# Altium project Mordovia_MCH_CLK.PrjPCB (part 1 of 2)
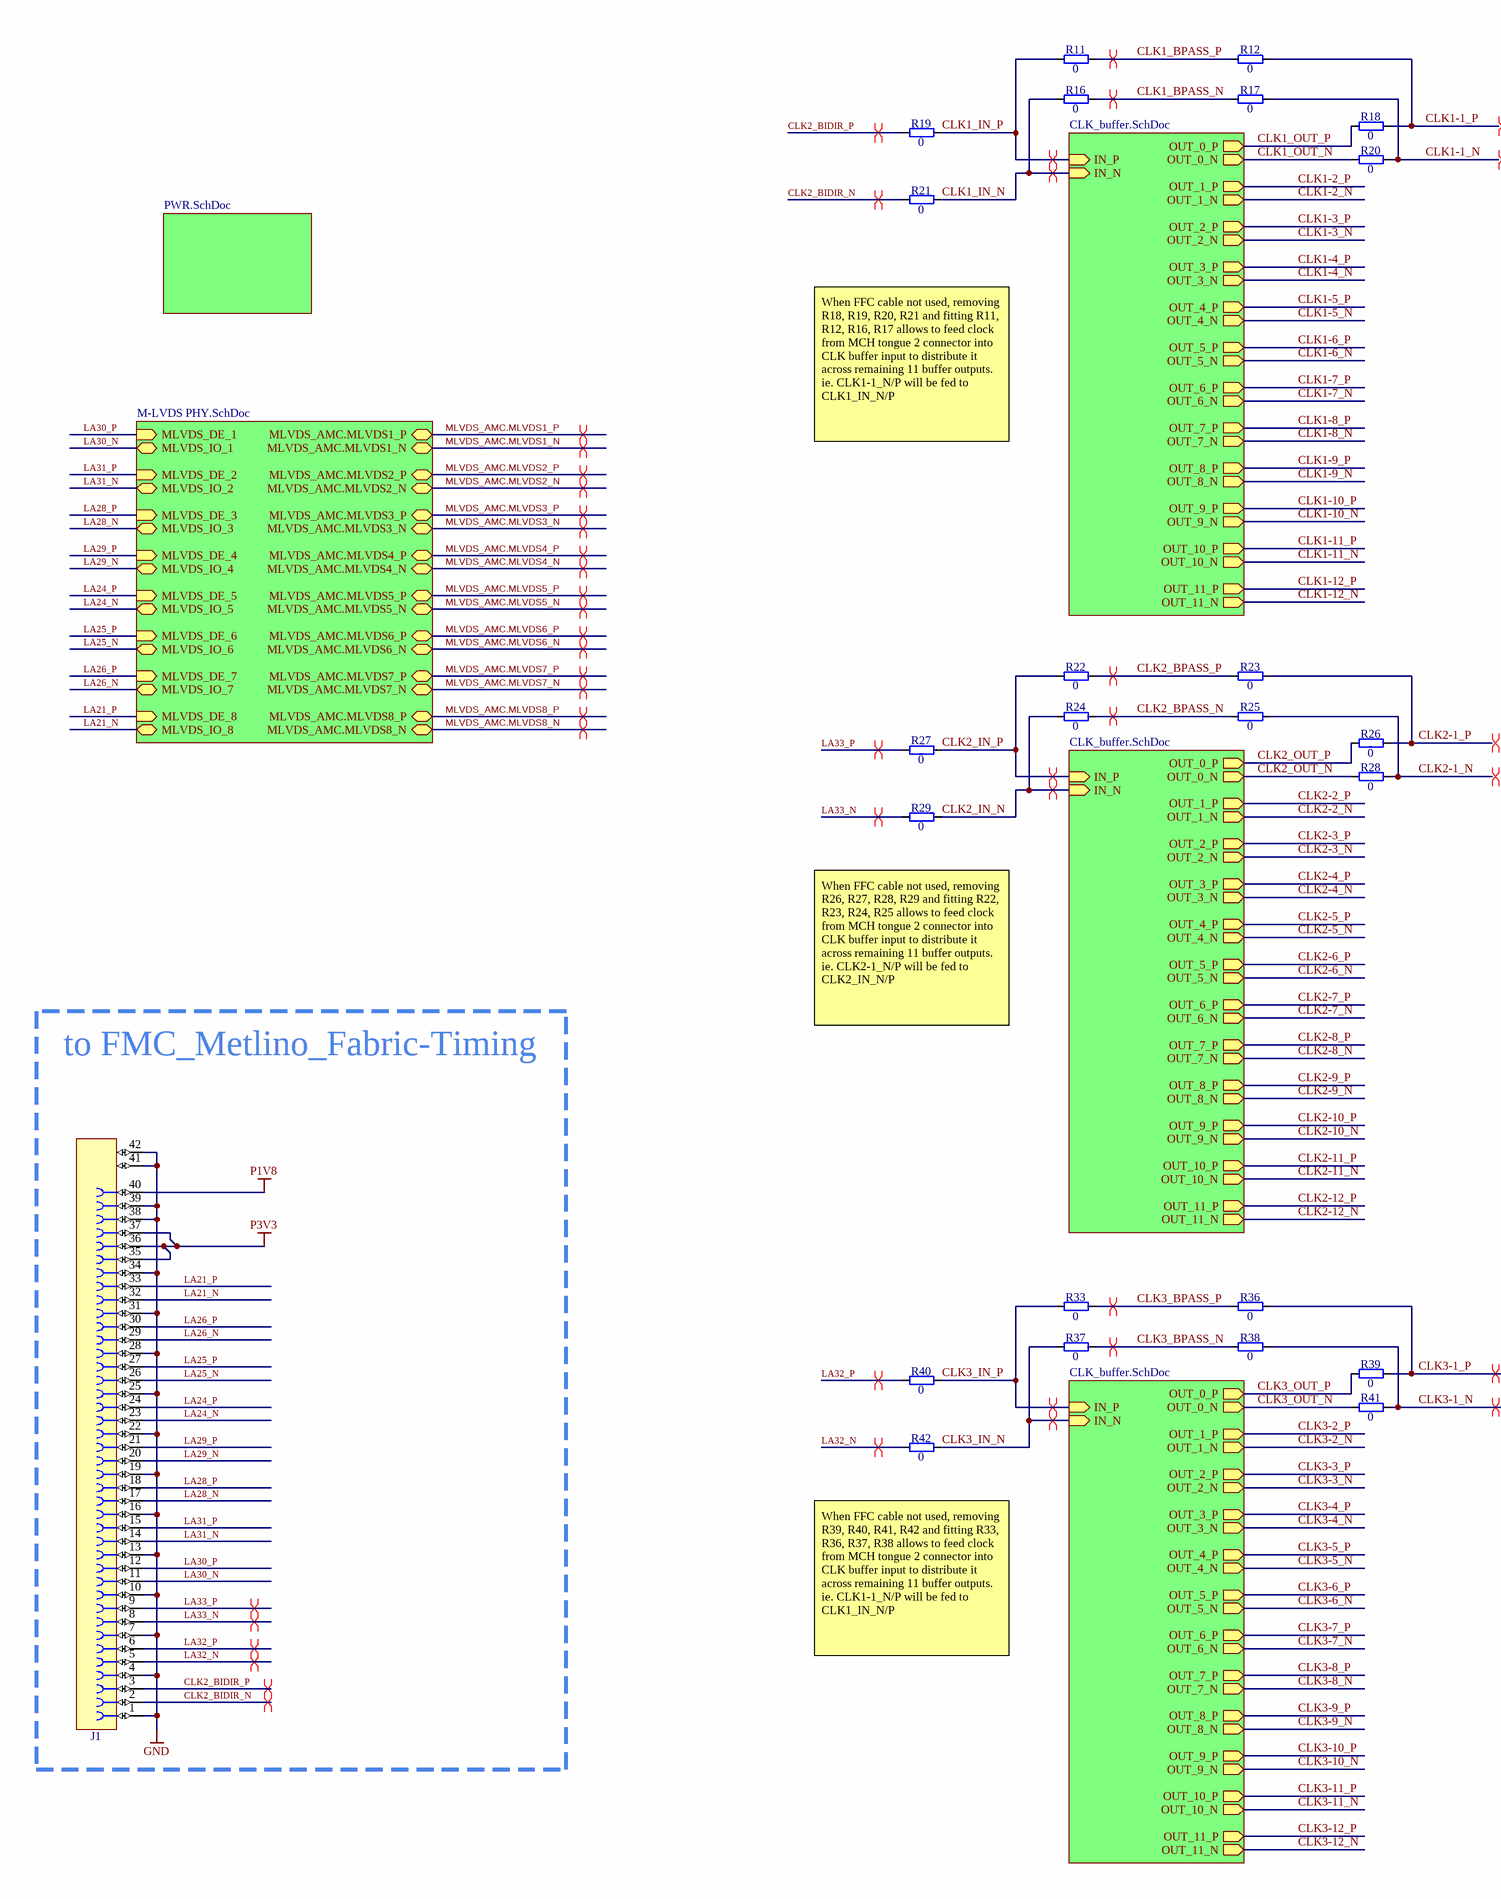
[diagram p0: Mordovia_MCH_CLK.SchDoc, left]
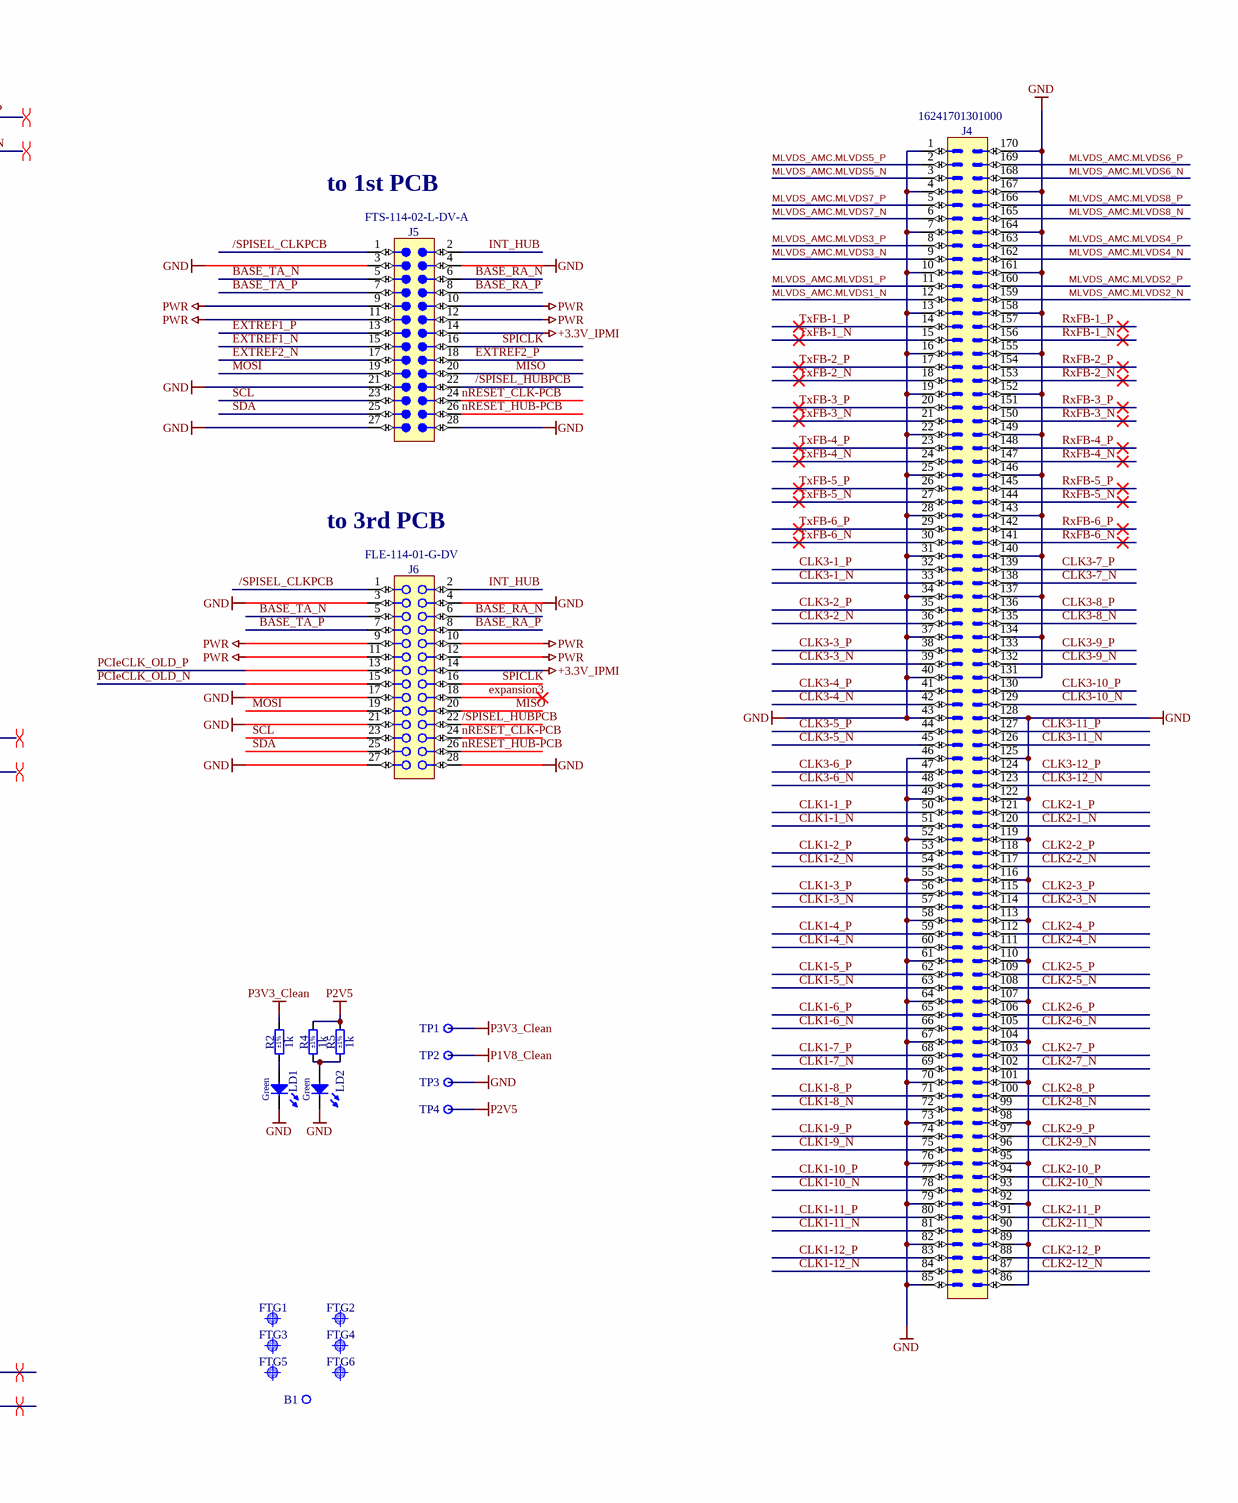
[diagram p1: Mordovia_MCH_CLK.SchDoc, right]
4 sheets, 182 parts. Net scope: hierarchical (ports join the sheet entries above them; power ports are global).
Board file: Mordovia_MCH_CLK.PcbDoc
Sheets:
  Mordovia_MCH_CLK.SchDoc
    2 = CLK_buffer.SchDoc
    3 = CLK_buffer.SchDoc
    m-lvds = M-LVDS PHY.SchDoc
    PWR = PWR.SchDoc
    1 = CLK_buffer.SchDoc

## Sheet Mordovia_MCH_CLK.SchDoc: Mordovia_MCH_CLK
size 594 x 420 mm; PageSetup: Record=PageOptions|CenterHorizontal=True|CenterVertical=True|PrintScale=0.73|XCorrection==PcbVersion0|YCorrection==PcbVersion0|PrintKind=2|BorderSize=5000000|LeftOffset=0|BottomOffset=0|Orientation=2|PaperLength=1000|PaperWidth=1000|Scale=100|PaperSource=7|PrintQuality=600|MediaType=1|DitherType=10|PaperKind=A4|PrintScaleMode=1; CheckedBy: -; CompanyName: PW ISE; DrawnBy: F. Świtakowski; Organization: ISE; Address1: WUT ISE; Address2: Nowowiejska 15/19 00-665 Warsaw; Address3: gkasprow@gmail.com; Revision: 1; SheetNumber: -; SheetTotal: -; Projet: Mordovia_MCH_CLK.PrjPCB; ModifiedBy: -; CreateDate: -; CheckedDate: -; Title2: Thongue 2 adapter; DivGrp: PERG; Designer: F. Świtakowski; ModifiedDate: -

### Parts
B1  Non Plated Hole  [MTG520]  (value not drawn)  (no BOM)
FTG1  Use only in PCB  [FIDUCIAL_TOP_S100-200]  (value not drawn)  (no BOM)
FTG2  Use only in PCB  [FIDUCIAL_TOP_S100-200]  (value not drawn)  (no BOM)
FTG3  Use only in PCB  [FIDUCIAL_TOP_S100-200]  (value not drawn)  (no BOM)
FTG4  Use only in PCB  [FIDUCIAL_TOP_S100-200]  (value not drawn)  (no BOM)
FTG5  Use only in PCB  [FIDUCIAL_TOP_S100-200]  (value not drawn)  (no BOM)
FTG6  Use only in PCB  [FIDUCIAL_TOP_S100-200]  (value not drawn)  (no BOM)
J1  FFC/FPC  [MOLEX_505110-4091]  (value not drawn)
J4  Manufacturer Part Number: 16241701301000  [ITB_16241701301000]
J5  Manufacturer Part Number: FTS-114-02-L-DV-A  [SAMTEC_FTS-114-02-L-DV-A]  (hidden comment: Header 28)
J6  Manufacturer Part Number: FLE-114-01-G-DV  [SAMTEC_FLE-114-01-G-DV]  (hidden comment: Socket 28)
LD1  Green  [LED_OSRAM_LGL29K]
LD2  Green  [LED_OSRAM_LGL29K]
R2  1k  Tolerance: ±1%  [RESC1005X40N]
R4  1k  Tolerance: ±1%  [RESC1005X40N]
R5  1k  Tolerance: ±1%  [RESC1005X40N]
R11  0  [RESC0603X28N]
R12  0  [RESC0603X28N]
R16  0  [RESC0603X28N]
R17  0  [RESC0603X28N]
R18  0  [RESC0603X28N]
R19  0  [RESC0603X28N]
R20  0  [RESC0603X28N]
R21  0  [RESC0603X28N]
R22  0  [RESC0603X28N]
R23  0  [RESC0603X28N]
R24  0  [RESC0603X28N]
R25  0  [RESC0603X28N]
R26  0  [RESC0603X28N]
R27  0  [RESC0603X28N]
R28  0  [RESC0603X28N]
R29  0  [RESC0603X28N]
R33  0  [RESC0603X28N]
R36  0  [RESC0603X28N]
R37  0  [RESC0603X28N]
R38  0  [RESC0603X28N]
R39  0  [RESC0603X28N]
R40  0  [RESC0603X28N]
R41  0  [RESC0603X28N]
R42  0  [RESC0603X28N]
TP1  Test Point  [TPS127]  (value not drawn)  (no BOM)
TP2  Test Point  [TPS127]  (value not drawn)  (no BOM)
TP3  Test Point  [TPS127]  (value not drawn)  (no BOM)
TP4  Test Point  [TPS127]  (value not drawn)  (no BOM)

### Blocks framed on the sheet
to FMC_Metlino_Fabric-Timing: J1

### Sub-sheets
1 = CLK_buffer.SchDoc: OUT_0_P (out), OUT_0_N (out), IN_P (in), IN_N (in), OUT_1_P (out), OUT_1_N (out), OUT_2_P (out), OUT_2_N (out), OUT_3_P (out), OUT_3_N (out), OUT_4_P (out), OUT_4_N (out), OUT_5_P (out), OUT_5_N (out), OUT_6_P (out), OUT_6_N (out), OUT_7_P (out), OUT_7_N (out), OUT_8_P (out), OUT_8_N (out), OUT_9_P (out), OUT_9_N (out), OUT_10_P (out), OUT_10_N (out), OUT_11_P (out), OUT_11_N (out)
2 = CLK_buffer.SchDoc: OUT_0_P (out), OUT_0_N (out), IN_P (in), IN_N (in), OUT_1_P (out), OUT_1_N (out), OUT_2_P (out), OUT_2_N (out), OUT_3_P (out), OUT_3_N (out), OUT_4_P (out), OUT_4_N (out), OUT_5_P (out), OUT_5_N (out), OUT_6_P (out), OUT_6_N (out), OUT_7_P (out), OUT_7_N (out), OUT_8_P (out), OUT_8_N (out), OUT_9_P (out), OUT_9_N (out), OUT_10_P (out), OUT_10_N (out), OUT_11_P (out), OUT_11_N (out)
3 = CLK_buffer.SchDoc: OUT_0_P (out), OUT_0_N (out), IN_P (in), IN_N (in), OUT_1_P (out), OUT_1_N (out), OUT_2_P (out), OUT_2_N (out), OUT_3_P (out), OUT_3_N (out), OUT_4_P (out), OUT_4_N (out), OUT_5_P (out), OUT_5_N (out), OUT_6_P (out), OUT_6_N (out), OUT_7_P (out), OUT_7_N (out), OUT_8_P (out), OUT_8_N (out), OUT_9_P (out), OUT_9_N (out), OUT_10_P (out), OUT_10_N (out), OUT_11_P (out), OUT_11_N (out)
m-lvds = M-LVDS PHY.SchDoc: MLVDS_DE_1 (in), MLVDS_IO_1 (bidir), MLVDS_AMC.MLVDS1_P (bidir), MLVDS_AMC.MLVDS1_N (bidir), MLVDS_DE_2 (in), MLVDS_IO_2 (bidir), MLVDS_AMC.MLVDS2_P (bidir), MLVDS_AMC.MLVDS2_N (bidir), MLVDS_DE_3 (in), MLVDS_IO_3 (bidir), MLVDS_AMC.MLVDS3_P (bidir), MLVDS_AMC.MLVDS3_N (bidir), MLVDS_DE_4 (in), MLVDS_IO_4 (bidir), MLVDS_AMC.MLVDS4_P (bidir), MLVDS_AMC.MLVDS4_N (bidir), MLVDS_DE_5 (in), MLVDS_IO_5 (bidir), MLVDS_AMC.MLVDS5_P (bidir), MLVDS_AMC.MLVDS5_N (bidir), MLVDS_DE_6 (in), MLVDS_IO_6 (bidir), MLVDS_AMC.MLVDS6_P (bidir), MLVDS_AMC.MLVDS6_N (bidir), MLVDS_DE_7 (in), MLVDS_IO_7 (bidir), MLVDS_AMC.MLVDS7_P (bidir), MLVDS_AMC.MLVDS7_N (bidir), MLVDS_DE_8 (in), MLVDS_IO_8 (bidir), MLVDS_AMC.MLVDS8_P (bidir), MLVDS_AMC.MLVDS8_N (bidir)
PWR = PWR.SchDoc: no entries

### Nets
+3.3V_IPMI: J5.14 J6.14
GND: J1.1 J1.4 J1.7 J1.10 J1.13 J1.16 J1.19 J1.22 J1.25 J1.28 J1.31 J1.34 J1.38 J1.39 J1.41 J1.42 J4.1 J4.4 J4.7 J4.10 J4.13 J4.16 J4.19 J4.22 J4.25 J4.28 J4.31 J4.34 J4.37 J4.40 J4.43 J4.46 J4.49 J4.52 J4.55 J4.58 J4.61 J4.64 J4.67 J4.70 J4.73 J4.76 J4.79 J4.82 J4.85 J4.86 J4.89 J4.92 J4.95 J4.98 J4.101 J4.104 J4.107 J4.110 J4.113 J4.116 J4.119 J4.122 J4.125 J4.128 J4.131 J4.134 J4.137 J4.140 J4.143 J4.146 J4.149 J4.152 J4.155 J4.158 J4.161 J4.164 J4.167 J4.170 J5.3 J5.4 J5.21 J5.27 J5.28 J6.3 J6.4 J6.17 J6.21 J6.27 J6.28 LD1.1(C) LD2.1(C) TP3.1
P1V8: J1.40
P1V8_Clean: TP2.1
P2V5: R4.2 R5.2 TP4.1
P3V3: J1.35 J1.36 J1.37
P3V3_Clean: R2.2 TP1.1
PWR: J5.9 J5.10 J5.11 J5.12 J6.9 J6.10 J6.11 J6.12
/SPISEL_CLKPCB: J5.1 J6.1
/SPISEL_HUBPCB: J5.22 J6.22
BASE_RA_N: J5.6 J6.6
BASE_RA_P: J5.8 J6.8
BASE_TA_N: J5.5 J6.5
BASE_TA_P: J5.7 J6.7
CLK1-1_N: J4.51 R17.2 R20.2
CLK1-1_P: J4.50 R12.2 R18.2
CLK1-2_N: J4.54 ; sheet 1/OUT_1_N
CLK1-2_P: J4.53 ; sheet 1/OUT_1_P
CLK1-3_N: J4.57 ; sheet 1/OUT_2_N
CLK1-3_P: J4.56 ; sheet 1/OUT_2_P
CLK1-4_N: J4.60 ; sheet 1/OUT_3_N
CLK1-4_P: J4.59 ; sheet 1/OUT_3_P
CLK1-5_N: J4.63 ; sheet 1/OUT_4_N
CLK1-5_P: J4.62 ; sheet 1/OUT_4_P
CLK1-6_N: J4.66 ; sheet 1/OUT_5_N
CLK1-6_P: J4.65 ; sheet 1/OUT_5_P
CLK1-7_N: J4.69 ; sheet 1/OUT_6_N
CLK1-7_P: J4.68 ; sheet 1/OUT_6_P
CLK1-8_N: J4.72 ; sheet 1/OUT_7_N
CLK1-8_P: J4.71 ; sheet 1/OUT_7_P
CLK1-9_N: J4.75 ; sheet 1/OUT_8_N
CLK1-9_P: J4.74 ; sheet 1/OUT_8_P
CLK1-10_N: J4.78 ; sheet 1/OUT_9_N
CLK1-10_P: J4.77 ; sheet 1/OUT_9_P
CLK1-11_N: J4.81 ; sheet 1/OUT_10_N
CLK1-11_P: J4.80 ; sheet 1/OUT_10_P
CLK1-12_N: J4.84 ; sheet 1/OUT_11_N
CLK1-12_P: J4.83 ; sheet 1/OUT_11_P
CLK1_BPASS_N: R16.2 R17.1
CLK1_BPASS_P: R11.2 R12.1
CLK1_IN_N: R16.1 R21.2 ; sheet 1/IN_N
CLK1_IN_P: R11.1 R19.2 ; sheet 1/IN_P
CLK1_OUT_N: R20.1 ; sheet 1/OUT_0_N
CLK1_OUT_P: R18.1 ; sheet 1/OUT_0_P
CLK2-1_N: J4.120 R25.2 R28.2
CLK2-1_P: J4.121 R23.2 R26.2
CLK2-2_N: J4.117 ; sheet 2/OUT_1_N
CLK2-2_P: J4.118 ; sheet 2/OUT_1_P
CLK2-3_N: J4.114 ; sheet 2/OUT_2_N
CLK2-3_P: J4.115 ; sheet 2/OUT_2_P
CLK2-4_N: J4.111 ; sheet 2/OUT_3_N
CLK2-4_P: J4.112 ; sheet 2/OUT_3_P
CLK2-5_N: J4.108 ; sheet 2/OUT_4_N
CLK2-5_P: J4.109 ; sheet 2/OUT_4_P
CLK2-6_N: J4.105 ; sheet 2/OUT_5_N
CLK2-6_P: J4.106 ; sheet 2/OUT_5_P
CLK2-7_N: J4.102 ; sheet 2/OUT_6_N
CLK2-7_P: J4.103 ; sheet 2/OUT_6_P
CLK2-8_N: J4.99 ; sheet 2/OUT_7_N
CLK2-8_P: J4.100 ; sheet 2/OUT_7_P
CLK2-9_N: J4.96 ; sheet 2/OUT_8_N
CLK2-9_P: J4.97 ; sheet 2/OUT_8_P
CLK2-10_N: J4.93 ; sheet 2/OUT_9_N
CLK2-10_P: J4.94 ; sheet 2/OUT_9_P
CLK2-11_N: J4.90 ; sheet 2/OUT_10_N
CLK2-11_P: J4.91 ; sheet 2/OUT_10_P
CLK2-12_N: J4.87 ; sheet 2/OUT_11_N
CLK2-12_P: J4.88 ; sheet 2/OUT_11_P
CLK2_BIDIR_N: J1.2 R21.1
CLK2_BIDIR_P: J1.3 R19.1
CLK2_BPASS_N: R24.2 R25.1
CLK2_BPASS_P: R22.2 R23.1
CLK2_IN_N: R24.1 R29.2 ; sheet 2/IN_N
CLK2_IN_P: R22.1 R27.2 ; sheet 2/IN_P
CLK2_OUT_N: R28.1 ; sheet 2/OUT_0_N
CLK2_OUT_P: R26.1 ; sheet 2/OUT_0_P
CLK3-1_N: J4.33 R38.2 R41.2
CLK3-1_P: J4.32 R36.2 R39.2
CLK3-2_N: J4.36 ; sheet 3/OUT_1_N
CLK3-2_P: J4.35 ; sheet 3/OUT_1_P
CLK3-3_N: J4.39 ; sheet 3/OUT_2_N
CLK3-3_P: J4.38 ; sheet 3/OUT_2_P
CLK3-4_N: J4.42 ; sheet 3/OUT_3_N
CLK3-4_P: J4.41 ; sheet 3/OUT_3_P
CLK3-5_N: J4.45 ; sheet 3/OUT_4_N
CLK3-5_P: J4.44 ; sheet 3/OUT_4_P
CLK3-6_N: J4.48 ; sheet 3/OUT_5_N
CLK3-6_P: J4.47 ; sheet 3/OUT_5_P
CLK3-7_N: J4.138 ; sheet 3/OUT_6_N
CLK3-7_P: J4.139 ; sheet 3/OUT_6_P
CLK3-8_N: J4.135 ; sheet 3/OUT_7_N
CLK3-8_P: J4.136 ; sheet 3/OUT_7_P
CLK3-9_N: J4.132 ; sheet 3/OUT_8_N
CLK3-9_P: J4.133 ; sheet 3/OUT_8_P
CLK3-10_N: J4.129 ; sheet 3/OUT_9_N
CLK3-10_P: J4.130 ; sheet 3/OUT_9_P
CLK3-11_N: J4.126 ; sheet 3/OUT_10_N
CLK3-11_P: J4.127 ; sheet 3/OUT_10_P
CLK3-12_N: J4.123 ; sheet 3/OUT_11_N
CLK3-12_P: J4.124 ; sheet 3/OUT_11_P
CLK3_BPASS_N: R37.2 R38.1
CLK3_BPASS_P: R33.2 R36.1
CLK3_IN_N: R37.1 R42.2 ; sheet 3/IN_N
CLK3_IN_P: R33.1 R40.2 ; sheet 3/IN_P
CLK3_OUT_N: R41.1 ; sheet 3/OUT_0_N
CLK3_OUT_P: R39.1 ; sheet 3/OUT_0_P
expansion3: J6.18
EXTREF1_N: J5.15
EXTREF1_P: J5.13
EXTREF2_N: J5.17
EXTREF2_P: J5.18
INT_HUB: J5.2 J6.2
LA21_N: J1.32 ; sheet m-lvds/MLVDS_IO_8
LA21_P: J1.33 ; sheet m-lvds/MLVDS_DE_8
LA24_N: J1.23 ; sheet m-lvds/MLVDS_IO_5
LA24_P: J1.24 ; sheet m-lvds/MLVDS_DE_5
LA25_N: J1.26 ; sheet m-lvds/MLVDS_IO_6
LA25_P: J1.27 ; sheet m-lvds/MLVDS_DE_6
LA26_N: J1.29 ; sheet m-lvds/MLVDS_IO_7
LA26_P: J1.30 ; sheet m-lvds/MLVDS_DE_7
LA28_N: J1.17 ; sheet m-lvds/MLVDS_IO_3
LA28_P: J1.18 ; sheet m-lvds/MLVDS_DE_3
LA29_N: J1.20 ; sheet m-lvds/MLVDS_IO_4
LA29_P: J1.21 ; sheet m-lvds/MLVDS_DE_4
LA30_N: J1.11 ; sheet m-lvds/MLVDS_IO_1
LA30_P: J1.12 ; sheet m-lvds/MLVDS_DE_1
LA31_N: J1.14 ; sheet m-lvds/MLVDS_IO_2
LA31_P: J1.15 ; sheet m-lvds/MLVDS_DE_2
LA32_N: J1.5 R42.1
LA32_P: J1.6 R40.1
LA33_N: J1.8 R29.1
LA33_P: J1.9 R27.1
MISO: J5.20 J6.20
MLVDS_AMC.MLVDS1_N: J4.12 ; sheet m-lvds/MLVDS_AMC.MLVDS1_N
MLVDS_AMC.MLVDS1_P: J4.11 ; sheet m-lvds/MLVDS_AMC.MLVDS1_P
MLVDS_AMC.MLVDS2_N: J4.159 ; sheet m-lvds/MLVDS_AMC.MLVDS2_N
MLVDS_AMC.MLVDS2_P: J4.160 ; sheet m-lvds/MLVDS_AMC.MLVDS2_P
MLVDS_AMC.MLVDS3_N: J4.9 ; sheet m-lvds/MLVDS_AMC.MLVDS3_N
MLVDS_AMC.MLVDS3_P: J4.8 ; sheet m-lvds/MLVDS_AMC.MLVDS3_P
MLVDS_AMC.MLVDS4_N: J4.162 ; sheet m-lvds/MLVDS_AMC.MLVDS4_N
MLVDS_AMC.MLVDS4_P: J4.163 ; sheet m-lvds/MLVDS_AMC.MLVDS4_P
MLVDS_AMC.MLVDS5_N: J4.3 ; sheet m-lvds/MLVDS_AMC.MLVDS5_N
MLVDS_AMC.MLVDS5_P: J4.2 ; sheet m-lvds/MLVDS_AMC.MLVDS5_P
MLVDS_AMC.MLVDS6_N: J4.168 ; sheet m-lvds/MLVDS_AMC.MLVDS6_N
MLVDS_AMC.MLVDS6_P: J4.169 ; sheet m-lvds/MLVDS_AMC.MLVDS6_P
MLVDS_AMC.MLVDS7_N: J4.6 ; sheet m-lvds/MLVDS_AMC.MLVDS7_N
MLVDS_AMC.MLVDS7_P: J4.5 ; sheet m-lvds/MLVDS_AMC.MLVDS7_P
MLVDS_AMC.MLVDS8_N: J4.165 ; sheet m-lvds/MLVDS_AMC.MLVDS8_N
MLVDS_AMC.MLVDS8_P: J4.166 ; sheet m-lvds/MLVDS_AMC.MLVDS8_P
MOSI: J5.19 J6.19
nRESET_CLK-PCB: J5.24 J6.24
nRESET_HUB-PCB: J5.26 J6.26
PCIeCLK_OLD_N: J6.15
PCIeCLK_OLD_P: J6.13
RxFB-1_N: J4.156
RxFB-1_P: J4.157
RxFB-2_N: J4.153
RxFB-2_P: J4.154
RxFB-3_N: J4.150
RxFB-3_P: J4.151
RxFB-4_N: J4.147
RxFB-4_P: J4.148
RxFB-5_N: J4.144
RxFB-5_P: J4.145
RxFB-6_N: J4.141
RxFB-6_P: J4.142
SCL: J5.23 J6.23
SDA: J5.25 J6.25
SPICLK: J5.16 J6.16
TxFB-1_N: J4.15
TxFB-1_P: J4.14
TxFB-2_N: J4.18
TxFB-2_P: J4.17
TxFB-3_N: J4.21
TxFB-3_P: J4.20
TxFB-4_N: J4.24
TxFB-4_P: J4.23
TxFB-5_N: J4.27
TxFB-5_P: J4.26
TxFB-6_N: J4.30
TxFB-6_P: J4.29
NetLD1_2: LD1.2(A) R2.1
NetLD2_2: LD2.2(A) R4.1 R5.1

Not connected (* = marked no-connect by the designer): B1 1

### Layout directives
differential pair: CLK1-1_N, CLK1-1_P, CLK1_BPASS_N, CLK1_BPASS_P, CLK1_IN_N, CLK1_IN_P, CLK2-1_N, CLK2-1_P, CLK2_BIDIR_N, CLK2_BIDIR_P, CLK2_BPASS_N, CLK2_BPASS_P, CLK2_IN_N, CLK2_IN_P, CLK3-1_N, CLK3-1_P, CLK3_BPASS_N, CLK3_BPASS_P, CLK3_IN_N, CLK3_IN_P, LA32_N, LA32_P, LA33_N, LA33_P, MLVDS_AMC.MLVDS1_N, MLVDS_AMC.MLVDS1_P, MLVDS_AMC.MLVDS2_N, MLVDS_AMC.MLVDS2_P, MLVDS_AMC.MLVDS3_N, MLVDS_AMC.MLVDS3_P, MLVDS_AMC.MLVDS4_N, MLVDS_AMC.MLVDS4_P, MLVDS_AMC.MLVDS5_N, MLVDS_AMC.MLVDS5_P, MLVDS_AMC.MLVDS6_N, MLVDS_AMC.MLVDS6_P, MLVDS_AMC.MLVDS7_N, MLVDS_AMC.MLVDS7_P, MLVDS_AMC.MLVDS8_N, MLVDS_AMC.MLVDS8_P

### Notes on the sheet
- to 1st PCB
- When FFC cable not used, removing R18, R19, R20, R21 and fitting R11, R12, R16, R17 allows to feed clock from MCH tongue 2 connector into CLK buffer input to distribute it across remaining 11 buffer outputs. ie. CLK1-1_N/P will be fed to CLK1_IN_N/P
- to 3rd PCB
- When FFC cable not used, removing R26, R27, R28, R29 and fitting R22, R23, R24, R25 allows to feed clock from MCH tongue 2 connector into CLK buffer input to distribute it across remaining 11 buffer outputs. ie. CLK2-1_N/P will be fed to CLK2_IN_N/P
- When FFC cable not used, removing R39, R40, R41, R42 and fitting R33, R36, R37, R38 allows to feed clock from MCH tongue 2 connector into CLK buffer input to distribute it across remaining 11 buffer outputs. ie. CLK1-1_N/P will be fed to CLK1_IN_N/P
- Project/Equipment
- Document
- File
- Designer
- Drawn by
- Check.by
- Last Mod.
- Copyright WUT ISE 2020.
  This documentation describes Open Hardware and is licensed under the CERN OHL v.1.2. You may redistribute and modify this documentation under the terms of the CERN OHL v.1.2. (http://ohwr.org/CERNOHL). This documentation is distributed WITHOUT ANY EXPRESS OR IMPLIED WARRANTY, INCLUDING OF MERCHANTABILITY, SATISFACTORY QUALITY AND FITNESS FOR A PARTICULAR PURPOSE. Please see the CERN OHL v.1.2 for applicable conditions.
- Contact
- Print Date
- Sheet
- Size
- A2
- of
- Rev

### Library data of the parts
B1 = NON-PLATED_HOLE5.2: Single Terminal Socket; Part Description: Non Plated Through Hole: Hole Dia.=5.2mm; Mounted: No; Part Number: NON-PLATED_HOLE5.2; Component Type: Standard (No BOM); Pin Count: 1; Family: Non Plated Hole; Socket: No; SMD: No; Sense: No; Status: None; ComponentHeight: 0mm; HelpURL: Undefined; Author: CERN DEM JMW; CreateDate: 27.09.2011; LatestRevisionDate: 27.09.2011; PackageDescription: Non Plated Through Hole: Hole Dia.=5.2mm
FTG1-FTG6 = FIDUCIAL_TARGET_S100-200: Fiducial Target; Part Description: Square Fiducial Target, Top Layer, 1.0mm, Top Solder 2.0mm, Keepout =2.0mm; Mounted: No; Part Number: FIDUCIAL_TARGET_S100-200; Component Type: Standard (No BOM); Pin Count: 1; Family: Fiducial; Socket: No; SMD: Yes; Sense: No; Status: None; ComponentHeight: 0mm; HelpURL: Undefined; Author: CERN DEM JLC; CreateDate: 09.02.2010; LatestRevisionDate: 04.04.2012; PackageDescription: Square Fiducial Target, Top Layer, 1.0mm, Top Solder 2.0mm, Keepout =2.0mm
J1 = MOLEX_505110-4091: Connector 40 Female +2; Part Description: Easy-On FFC/FPC Connector 0.50mm Pitch, FD19 Series, Right-Angle, Bottom Contact, 40 Circuits; Manufacturer: MOLEX; PressFit: No; Part Number: MOLEX_505110-4091; Component Kind: Standard; Component Type: Standard; Pin Count: 42; Family: FFC/FPC; Mounted: Yes; Socket: No; SMD: Yes; Sense: No; Status: None; Manufacturer Part Number: 505110-4091; ComponentHeight: 1.92mm; HelpURL: \\cern.ch\dfs\Applications\Altium\Datasheets\MOLEX_505110-4091.pdf; Author: CERN DEM JMW; CreateDate: 22.01.2019; LatestRevisionDate: 22.01.2019
J4 = ITB_16241701301000: Connector 170 Male; Part Description: 170 Poles, MCH-Plug Connector (Basic Side); Manufacturer: ITB ADVANCED CONNECTORS; PressFit: No; Part Number: ITB_16241701301000; Component Kind: Standard; Component Type: Standard; Pin Count: 170; Family: AvancedMC; Mounted: Yes; Socket: No; SMD: No; Sense: No; Status: None; ComponentHeight: 7.63mm; HelpURL: \\cern.ch\dfs\Applications\Altium\Datasheets\ITB_16241701301000.pdf; Author: CERN DEM MR; CreateDate: 17.05.2016; LatestRevisionDate: 17.05.2016
J5 = SAMTEC_FTS-114-02-L-DV-A: Connector 28 Male; Part Description: 28 Contacts, Pitch 1.27mm - Dual Row Surface Mount Straight Strip Header; Manufacturer: SAMTEC; PressFit: No; Part Number: SAMTEC_FTS-114-02-L-DV-A; Component Kind: Standard; Component Type: Standard; Pin Count: 28; Family: Header 28; Mounted: Yes; Socket: No; Sense: No; SMD: Yes; Status: None; ComponentHeight: 3.18mm; HelpURL: \\cern.ch\dfs\Applications\Altium\Datasheets\SAMTEC_FTS-114-02-L-DV-A.pdf; Author: CERN DEM MR; CreateDate: 07.03.2016; LatestRevisionDate: 07.03.2016
J6 = SAMTEC_FLE-114-01-G-DV: Connector 28 Female; Part Description: 28 Contacts - Pitch 1.27mm - Dual Row Surface Mount Receptacle; Manufacturer: SAMTEC; PressFit: No; Part Number: SAMTEC_FLE-114-01-G-DV; Component Kind: Standard; Component Type: Standard; Pin Count: 28; Family: Socket 28; Mounted: Yes; Socket: No; Sense: No; SMD: Yes; Status: None; ComponentHeight: 4.55mm; HelpURL: \\cern.ch\dfs\Applications\Altium\Datasheets\SAMTEC_FLE-114-01-G-DV.pdf; Author: CERN DEM MR; CreateDate: 07.03.2016; LatestRevisionDate: 07.03.2016
LD1 LD2 = LED_OSRAM_LG L29K-G2J1-24-Z: LED Green 1C 2A; Part Description: Surface Mount Green LED (0603 Case); Manufacturer: OSRAM; PressFit: No; Bonding: No; Status Comment: Sourcing Difficulty; Part Number: LED_OSRAM_LG L29K-G2J1-24-Z; Component Kind: Standard; Component Type: Standard; Color: Green; PackageDescription: Green Chip LED, 2-Leads, Body 1.7x0.8mm, IPC Medium Density; Status: Not Recommended; Manufacturer Part Number: LG L29K-G2J1-24-Z; Pin Count: 2; Case: 0603; Mounted: Yes; Socket: No; SMD: Yes; Sense: No; ComponentHeight: 0.67mm; HelpURL: \\cern.ch\dfs\Applications\Altium\Datasheets\LED_OSRAM_LGL29K.pdf; Author: CERN DEM JLC; CreateDate: 24.04.2012; LatestRevisionDate: 24.04.2012
R2 R4 R5 = R0402_1K_1%_0.0625W_100PPM: Resistor - 1%; Part Description: General Purpose Thick Film Chip Resistor; Manufacturer: GENERIC; Manufacturer1 Part Number: 232270671002L; TC: ±100ppm/°C; PressFit: No; Part Number: R0402_1K_1%_0.0625W_100PPM; Component Kind: Standard; Component Type: Standard; Pin Count: 2; Value: 1k; Status: Not Recommended; Power: 0.0625W; Manufacturer Part Number: R0402_1K_1%_0.0625W_100PPM; Case: 0402; Mounted: Yes; Sense: No; Socket: No; SMD: Yes; Manufacturer1 Example: YAGEO PHYCOMP; Manufacturer1 ComponentHeight: 0.4mm; HelpURL: \\cern.ch\dfs\Applications\Altium\Datasheets\R0402_Phycomp_RC0402.pdf; Author: CERN DEM JLC; CreateDate: 03.12.2007; LatestRevisionDate: 17.10.2012
R11 R12 R16-R29 R33 R36-R42 = R0201_0R_JUMPER: Resistor; Part Description: 1A (0.05R Max DC Resistance) Zero Ohm Jumper; Manufacturer: GENERIC; Manufacturer1 Part Number: CRCW02010000Z0ED; PressFit: No; Part Number: R0201_0R_JUMPER; Component Kind: Standard; Component Type: Standard; Pin Count: 2; Value: 0; Status: Not Recommended; Manufacturer Part Number: R0201_0R_JUMPER; Case: 0201; Mounted: Yes; Sense: No; Socket: No; SMD: Yes; Manufacturer1 Example: VISHAY; Manufacturer1 ComponentHeight: 0.27mm; HelpURL: \\cern.ch\dfs\Applications\Altium\Datasheets\R0201_VISHAY_CRCW e3.pdf; Author: CERN DEM JLC; CreateDate: 11/19/2014; LatestRevisionDate: 1/8/2015
TP1-TP4 = SMD_PAD_1.27X1.27MM: Part Description: 1.27mm x 1.27mm PCB Copper Area (SMD Test Point); Mounted: No; Part Number: SMD_PAD_1.27X1.27MM; Component Type: Standard (No BOM); Pin Count: 1; Family: Test Point; Socket: No; SMD: No; Sense: No; Status: None; ComponentHeight: 0mm; HelpURL: Undefined; Author: CERN DEM JLC; CreateDate: 12.01.2008; LatestRevisionDate: 12.01.2008; PackageDescription: 1.27mm x 1.27mm PCB Copper Area (SMD Test Point)

## Sheet CLK_buffer.SchDoc: Mordovia_MCH_CLK
size A4; Author: Filip Świtakowski; DrawnBy: Filip Świtakowski; DocumentNumber: 2; Revision: 1.0; SheetNumber: 2; SheetTotal: 4; ModifiedBy: -; CheckedDate: -; Title2: CLK_buffer; DivGrp: WUT ISE; Designer: Filip Świtakowski
Used 3 times, as channels 2, 3, 1. Parts and nets are listed once, with the designators drawn on the sheet.
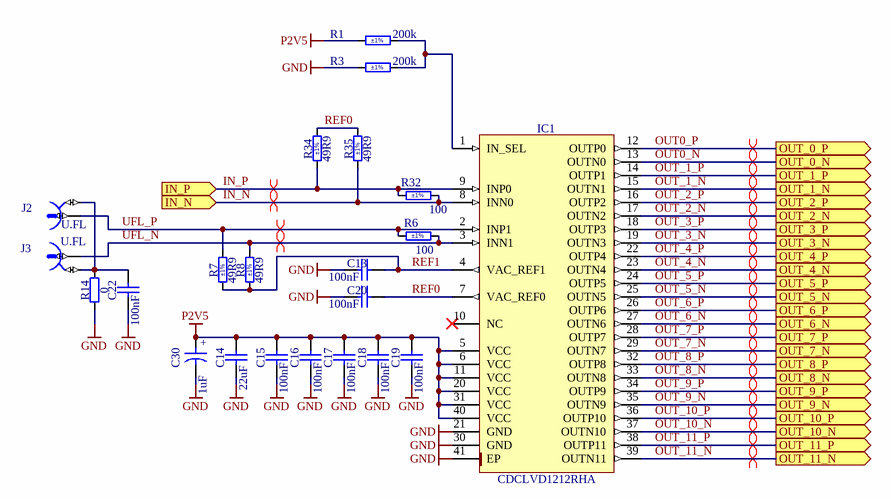
[diagram p2: CLK_buffer.SchDoc]

### Parts
C13  100nF  [CAPC1005X55N]
C14  22uF  [CAPC2012X135N]
C15  100nF  [CAPC1005X55N]
C16  100nF  [CAPC1005X55N]
C17  100nF  [CAPC1005X55N]
C18  100nF  [CAPC1005X55N]
C19  100nF  [CAPC1005X55N]
C20  100nF  [CAPC1005X55N]
C22  100nF  [CAPC1005X55N]
C30  1uF  [CAPMP3216X180N]
IC1  CDCLVD1212RHA  [QFN50P600X600X100-41N-S425]
J2  U.FL  [HIROSE_U.FL-R-SMT-1(10)]
J3  U.FL  [HIROSE_U.FL-R-SMT-1(10)]
R1  200k  Tolerance: ±1%  [RESC1005X40N]
R3  200k  Tolerance: ±1%  [RESC1005X40N]
R6  100  Tolerance: ±1%  [RESC1005X40N]
R7  49R9  Tolerance: ±1%  [RESC1005X40N]
R8  49R9  Tolerance: ±1%  [RESC1005X40N]
R14  0  [RESC1005X40N]
R32  100  Tolerance: ±1%  [RESC1005X40N]
R34  49R9  Tolerance: ±1%  [RESC1005X40N]
R35  49R9  Tolerance: ±1%  [RESC1005X40N]

### Ports
IN_N (in), IN_P (in), OUT_0_N (out), OUT_0_P (out), OUT_1_N (out), OUT_1_P (out), OUT_2_N (out), OUT_2_P (out), OUT_3_N (out), OUT_3_P (out), OUT_4_N (out), OUT_4_P (out), OUT_5_N (out), OUT_5_P (out), OUT_6_N (out), OUT_6_P (out), OUT_7_N (out), OUT_7_P (out), OUT_8_N (out), OUT_8_P (out), OUT_9_N (out), OUT_9_P (out), OUT_10_N (out), OUT_10_P (out), OUT_11_N (out), OUT_11_P (out)

### Nets
GND: C13.1 C14.1 C15.1 C16.1 C17.1 C18.1 C19.1 C20.1 C22.1 C30.2 IC1.21(GND) IC1.30(GND) IC1.41(EP) R3.1 R14.1
P2V5: C14.2 C15.2 C16.2 C17.2 C18.2 C19.2 C30.1 IC1.5(VCC) IC1.6(VCC) IC1.11(VCC) IC1.20(VCC) IC1.31(VCC) IC1.40(VCC) R1.1
IN_N: IC1.8(INN0) R32.2 R35.1 ; port IN_N
IN_P: IC1.9(INP0) R32.1 R34.1 ; port IN_P
OUT0_N: IC1.13(OUTN0) ; port OUT_0_N
OUT0_P: IC1.12(OUTP0) ; port OUT_0_P
OUT_1_N: IC1.15(OUTN1) ; port OUT_1_N
OUT_1_P: IC1.14(OUTP1) ; port OUT_1_P
OUT_2_N: IC1.17(OUTN2) ; port OUT_2_N
OUT_2_P: IC1.16(OUTP2) ; port OUT_2_P
OUT_3_N: IC1.19(OUTN3) ; port OUT_3_N
OUT_3_P: IC1.18(OUTP3) ; port OUT_3_P
OUT_~{4}_N: IC1.23(OUTN4) ; port OUT_4_N
OUT_4_P: IC1.22(OUTP4) ; port OUT_4_P
OUT_5_N: IC1.25(OUTN5) ; port OUT_5_N
OUT_5_P: IC1.24(OUTP5) ; port OUT_5_P
OUT_6_N: IC1.27(OUTN6) ; port OUT_6_N
OUT_6_P: IC1.26(OUTP6) ; port OUT_6_P
OUT_7_N: IC1.29(OUTN7) ; port OUT_7_N
OUT_7_P: IC1.28(OUTP7) ; port OUT_7_P
OUT_8_N: IC1.33(OUTN8) ; port OUT_8_N
OUT_8_P: IC1.32(OUTP8) ; port OUT_8_P
OUT_9_N: IC1.35(OUTN9) ; port OUT_9_N
OUT_9_P: IC1.34(OUTP9) ; port OUT_9_P
OUT_10_N: IC1.37(OUTN10) ; port OUT_10_N
OUT_10_P: IC1.36(OUTP10) ; port OUT_10_P
OUT_11_N: IC1.39(OUTN11) ; port OUT_11_N
OUT_11_P: IC1.38(OUTP11) ; port OUT_11_P
REF0: C20.2 IC1.7(VAC_REF0) R34.2 R35.2
REF1: C13.2 IC1.4(VAC_REF1) R7.1 R8.1
UFL_N: IC1.3(INN1) J3.1 R6.2 R8.2
UFL_P: IC1.2(INP1) J2.1 R6.1 R7.2
NetC22_2: C22.2 J2.2 J3.2 R14.2
NetIC1_1: IC1.1(IN_SEL) R1.2 R3.2

Not connected (* = marked no-connect by the designer): IC1 10(NC)*

### Channels
2: designators end in _2; ports IN_N=CLK2_IN_N IN_P=CLK2_IN_P OUT_0_N=CLK2_OUT_N OUT_0_P=CLK2_OUT_P OUT_1_N=CLK2-2_N OUT_1_P=CLK2-2_P OUT_2_N=CLK2-3_N OUT_2_P=CLK2-3_P OUT_3_N=CLK2-4_N OUT_3_P=CLK2-4_P OUT_4_N=CLK2-5_N OUT_4_P=CLK2-5_P OUT_5_N=CLK2-6_N OUT_5_P=CLK2-6_P OUT_6_N=CLK2-7_N OUT_6_P=CLK2-7_P OUT_7_N=CLK2-8_N OUT_7_P=CLK2-8_P OUT_8_N=CLK2-9_N OUT_8_P=CLK2-9_P OUT_9_N=CLK2-10_N OUT_9_P=CLK2-10_P OUT_10_N=CLK2-11_N OUT_10_P=CLK2-11_P OUT_11_N=CLK2-12_N OUT_11_P=CLK2-12_P
3: designators end in _3; ports IN_N=CLK3_IN_N IN_P=CLK3_IN_P OUT_0_N=CLK3_OUT_N OUT_0_P=CLK3_OUT_P OUT_1_N=CLK3-2_N OUT_1_P=CLK3-2_P OUT_2_N=CLK3-3_N OUT_2_P=CLK3-3_P OUT_3_N=CLK3-4_N OUT_3_P=CLK3-4_P OUT_4_N=CLK3-5_N OUT_4_P=CLK3-5_P OUT_5_N=CLK3-6_N OUT_5_P=CLK3-6_P OUT_6_N=CLK3-7_N OUT_6_P=CLK3-7_P OUT_7_N=CLK3-8_N OUT_7_P=CLK3-8_P OUT_8_N=CLK3-9_N OUT_8_P=CLK3-9_P OUT_9_N=CLK3-10_N OUT_9_P=CLK3-10_P OUT_10_N=CLK3-11_N OUT_10_P=CLK3-11_P OUT_11_N=CLK3-12_N OUT_11_P=CLK3-12_P
1: designators end in _1; ports IN_N=CLK1_IN_N IN_P=CLK1_IN_P OUT_0_N=CLK1_OUT_N OUT_0_P=CLK1_OUT_P OUT_1_N=CLK1-2_N OUT_1_P=CLK1-2_P OUT_2_N=CLK1-3_N OUT_2_P=CLK1-3_P OUT_3_N=CLK1-4_N OUT_3_P=CLK1-4_P OUT_4_N=CLK1-5_N OUT_4_P=CLK1-5_P OUT_5_N=CLK1-6_N OUT_5_P=CLK1-6_P OUT_6_N=CLK1-7_N OUT_6_P=CLK1-7_P OUT_7_N=CLK1-8_N OUT_7_P=CLK1-8_P OUT_8_N=CLK1-9_N OUT_8_P=CLK1-9_P OUT_9_N=CLK1-10_N OUT_9_P=CLK1-10_P OUT_10_N=CLK1-11_N OUT_10_P=CLK1-11_P OUT_11_N=CLK1-12_N OUT_11_P=CLK1-12_P

### Layout directives
differential pair: CLK2-2_N, CLK2-2_P, CLK2-3_N, CLK2-3_P, CLK2-4_N, CLK2-4_P, CLK2-5_N, CLK2-5_P, CLK2-6_N, CLK2-6_P, CLK2-7_N, CLK2-7_P, CLK2-8_N, CLK2-8_P, CLK2-9_N, CLK2-9_P, CLK2-10_N, CLK2-10_P, CLK2-11_N, CLK2-11_P, CLK2-12_N, CLK2-12_P, CLK2_IN_N, CLK2_IN_P, CLK2_OUT_N, CLK2_OUT_P, UFL_N_2, UFL_P_2

### Notes on the sheet
- Project/Equipment
- Document
- Designer
- Drawn by
- Check.by
- 01.20201
- PW ISE
- Contact
- File
- Last Mod.
- Print Date
- Sheet
- Size
- A4
- of
- Rev
- Copyright WUT ISE 2021.
  This documentation describes Open Hardware and is licensed under the CERN OHL v.1.2. You may redistribute and modify this documentation under the terms of the CERN OHL v.1.2. (http://ohwr.org/CERNOHL). This documentation is distributed WITHOUT ANY EXPRESS OR IMPLIED WARRANTY, INCLUDING OF MERCHANTABILITY, SATISFACTORY QUALITY AND FITNESS FOR A PARTICULAR PURPOSE. Please see the CERN OHL v.1.2 for applicable conditions.
- Nowowiejska 15/19 00-665 Warsaw
- (in symbol CTE3216-18_1UF_16V_10%) +

### Library data of the parts
C13 C15-C20 C22 = CC0402_100NF_50V_10%_X7R: Non-polarised capacitor; Part Description: SMD Multilayer Chip Ceramic Capacitor; Manufacturer: GENERIC; Manufacturer1 Part Number: GRM155R71H104KE14D; Voltage: 50V; TC: X7R; Tolerance: ±10%; Part Number: CC0402_100NF_50V_10%_X7R; Component Kind: Standard; Component Type: Standard; Pin Count: 2; Value: 100nF; Status: None; Manufacturer Part Number: CC0402_100NF_50V_10%_X7R; Case: 0402; Mounted: Yes; Socket: No; SMD: Yes; Sense: No; Manufacturer1 Example: MURATA; Manufacturer1 ComponentHeight: 0.55mm; HelpURL: \\cern.ch\dfs\Applications\Altium\Datasheets\CC0402_MURATA_GRM155R71H104KE14D.pdf; Author: CERN DEM MR; CreateDate: 30.06.2017; LatestRevisionDate: 30.06.2017
C14 = CC0805_22UF_16V_10%_X5R: Non-polarised capacitor; Part Description: SMD Multilayer Chip Ceramic Capacitor; Manufacturer: GENERIC; Manufacturer1 Part Number: C2012X5R1C226KT; Voltage: 16V; TC: X5R; Tolerance: ±10%; Part Number: CC0805_22UF_16V_10%_X5R; Component Kind: Standard; Component Type: Standard; Pin Count: 2; Value: 22uF; Status: Preferred; Manufacturer Part Number: CC0805_22UF_16V_10%_X5R; Case: 0805; Mounted: Yes; Socket: No; SMD: Yes; Sense: No; Manufacturer1 Example: TDK; Manufacturer1 ComponentHeight: 1.35mm; HelpURL: \\cern.ch\dfs\Applications\Altium\Datasheets\CC0805_X5R_TDK_C.pdf; Author: CERN DEM JLC; CreateDate: 25.10.2012; LatestRevisionDate: 25.10.2012
C30 = CTE3216-18_1UF_16V_10%: Polarised capacitor; Part Description: Solid Tantalum Chip Capacitor; Manufacturer: GENERIC; Manufacturer1 Part Number: TAJA105K016RNJ; Voltage: 16V; Tolerance: ±10%; Part Number: CTE3216-18_1UF_16V_10%; Component Kind: Standard; Component Type: Standard; Pin Count: 2; Value: 1uF; Status: Preferred; Manufacturer Part Number: CTE3216-18_1UF_16V_10%; Case: A; Mounted: Yes; Socket: No; SMD: Yes; Sense: No; Manufacturer1 Example: AVX; Manufacturer1 ComponentHeight: 1.8mm; HelpURL: \\cern.ch\dfs\Applications\Altium\Datasheets\CTE_AVX_TAJ.pdf; Author: CERN DEM JLC; CreateDate: 03.09.2012; LatestRevisionDate: 03.09.2012
IC1 = CDCLVD1212RHA: 2:12 Low Additive Jitter LVDS Buffer; Manufacturer: TEXAS INSTRUMENTS; PressFit: No; Bonding: No; Part Number: CDCLVD1212RHA; Component Kind: Standard; Component Type: Standard; Device: CDCLVD1212RHA; PackageDescription: QFN, 0.50mm Pitch, Square; 40 pin, 6.00mm L X 6.00mm W X 1.00mm H body (w/Thermal Tab 4.25 X 4.25mm), IPC Medium Density; Part Description: 2:12 Low Additive Jitter LVDS Buffer; Manufacturer Part Number: CDCLVD1212RHA; Pin Count: 41; Case: QFN40; Mounted: Yes; Socket: No; SMD: Yes; Sense: No; ComponentHeight: 1mm; HelpURL: \\cern.ch\dfs\Applications\Altium\Datasheets\CDCLVD1212RHA.pdf; Author: CERN DEM MR; CreateDate: 15.09.2017; LatestRevisionDate: 15.09.2017
J2 J3 = HIROSE_U.FL-R-SMT-1(10): Manufacturer: HIROSE (HRS); Part Description: Up to 6GHz Ultra Small Surface Mount Male Coaxial Connectors U.FL Series; PressFit: No; Manufacturer Part Number: U.FL-R-SMT-1(10); Part Number: HIROSE_U.FL-R-SMT-1(10); Component Kind: Standard; Component Type: Standard; Pin Count: 2; Family: U.FL; Mounted: Yes; Socket: No; SMD: Yes; Sense: No; Status: None; ComponentHeight: 1.25mm; HelpURL: \\cern.ch\dfs\Applications\Altium\Datasheets\HIROSE_U.FL-R-SMT-1(10).pdf; Author: CERN DEM JLC; CreateDate: 24.03.2010; LatestRevisionDate: 24.03.2010
R1 R3 = R0402_200K_1%_0.0625W_100PPM: Resistor - 1%; Part Description: General Purpose Thick Film Chip Resistor; Manufacturer: GENERIC; Manufacturer1 Part Number: 232270672004L; TC: ±100ppm/°C; PressFit: No; Part Number: R0402_200K_1%_0.0625W_100PPM; Component Kind: Standard; Component Type: Standard; Pin Count: 2; Value: 200k; Status: Not Recommended; Power: 0.0625W; Manufacturer Part Number: R0402_200K_1%_0.0625W_100PPM; Case: 0402; Mounted: Yes; Sense: No; Socket: No; SMD: Yes; Manufacturer1 Example: YAGEO PHYCOMP; Manufacturer1 ComponentHeight: 0.4mm; HelpURL: \\cern.ch\dfs\Applications\Altium\Datasheets\R0402_Phycomp_RC0402.pdf; Author: CERN DEM JLC; CreateDate: 03.12.2007; LatestRevisionDate: 17.10.2012
R6 R32 = R0402_100R_1%_0.0625W_100PPM: Resistor - 1%; Part Description: General Purpose Thick Film Chip Resistor; Manufacturer: GENERIC; Manufacturer1 Part Number: 232270671001L; TC: ±100ppm/°C; PressFit: No; Part Number: R0402_100R_1%_0.0625W_100PPM; Component Kind: Standard; Component Type: Standard; Pin Count: 2; Value: 100; Status: Not Recommended; Power: 0.0625W; Manufacturer Part Number: R0402_100R_1%_0.0625W_100PPM; Case: 0402; Mounted: Yes; Sense: No; Socket: No; SMD: Yes; Manufacturer1 Example: YAGEO PHYCOMP; Manufacturer1 ComponentHeight: 0.4mm; HelpURL: \\cern.ch\dfs\Applications\Altium\Datasheets\R0402_Phycomp_RC0402.pdf; Author: CERN DEM JLC; CreateDate: 03.12.2007; LatestRevisionDate: 17.10.2012
R7 R8 R34 R35 = R0402_49R9_1%_0.0625W_100PPM: Resistor - 1%; Part Description: General Purpose Thick Film Chip Resistor; Manufacturer: GENERIC; Manufacturer1 Part Number: 232270674999L or RC0402FR-0749R9L; TC: ±100ppm/°C; PressFit: No; Part Number: R0402_49R9_1%_0.0625W_100PPM; Component Kind: Standard; Component Type: Standard; Pin Count: 2; Value: 49R9; Status: Not Recommended; Power: 0.0625W; Manufacturer Part Number: R0402_49R9_1%_0.0625W_100PPM; Case: 0402; Mounted: Yes; Sense: No; Socket: No; SMD: Yes; Manufacturer1 Example: YAGEO PHYCOMP; Manufacturer1 ComponentHeight: 0.4mm; HelpURL: \\cern.ch\dfs\Applications\Altium\Datasheets\R0402_Phycomp_RC0402.pdf; Author: CERN DEM JLC; CreateDate: 24.10.2012; LatestRevisionDate: 24.10.2012
R14 = R0402_0R_JUMPER: Resistor; Manufacturer: GENERIC; Part Description: 1A (0.05R Max DC Resistance) Zero Ohm Jumper; Manufacturer1 Part Number: 232270591001L; PressFit: No; Manufacturer Part Number: R0402_0R_JUMPER; Part Number: R0402_0R_JUMPER; Value: 0; Component Kind: Standard; Component Type: Standard; Pin Count: 2; Status: Not Recommended; Case: 0402; Mounted: Yes; Sense: No; Socket: No; SMD: Yes; Manufacturer1 Example: YAGEO PHYCOMP; Manufacturer1 ComponentHeight: 0.4mm; HelpURL: \\cern.ch\dfs\Applications\Altium\Datasheets\R0402_Phycomp_RC0402.pdf; Author: CERN DEM JLC; CreateDate: 03.12.2007; LatestRevisionDate: 17.10.2012

## Sheet M-LVDS PHY.SchDoc: Mordovia_MCH_CLK
size 420 x 297 mm; Date: 2021; DrawnBy: Filip Świtakowski; DocumentNumber: 3; Revision: 1.0; SheetNumber: 3; SheetTotal: 4; ModifiedBy: -; CheckedDate: -; Title2: M-LVDS PHY; DivGrp: WUT ISE; Designer: Filip Świtakowski
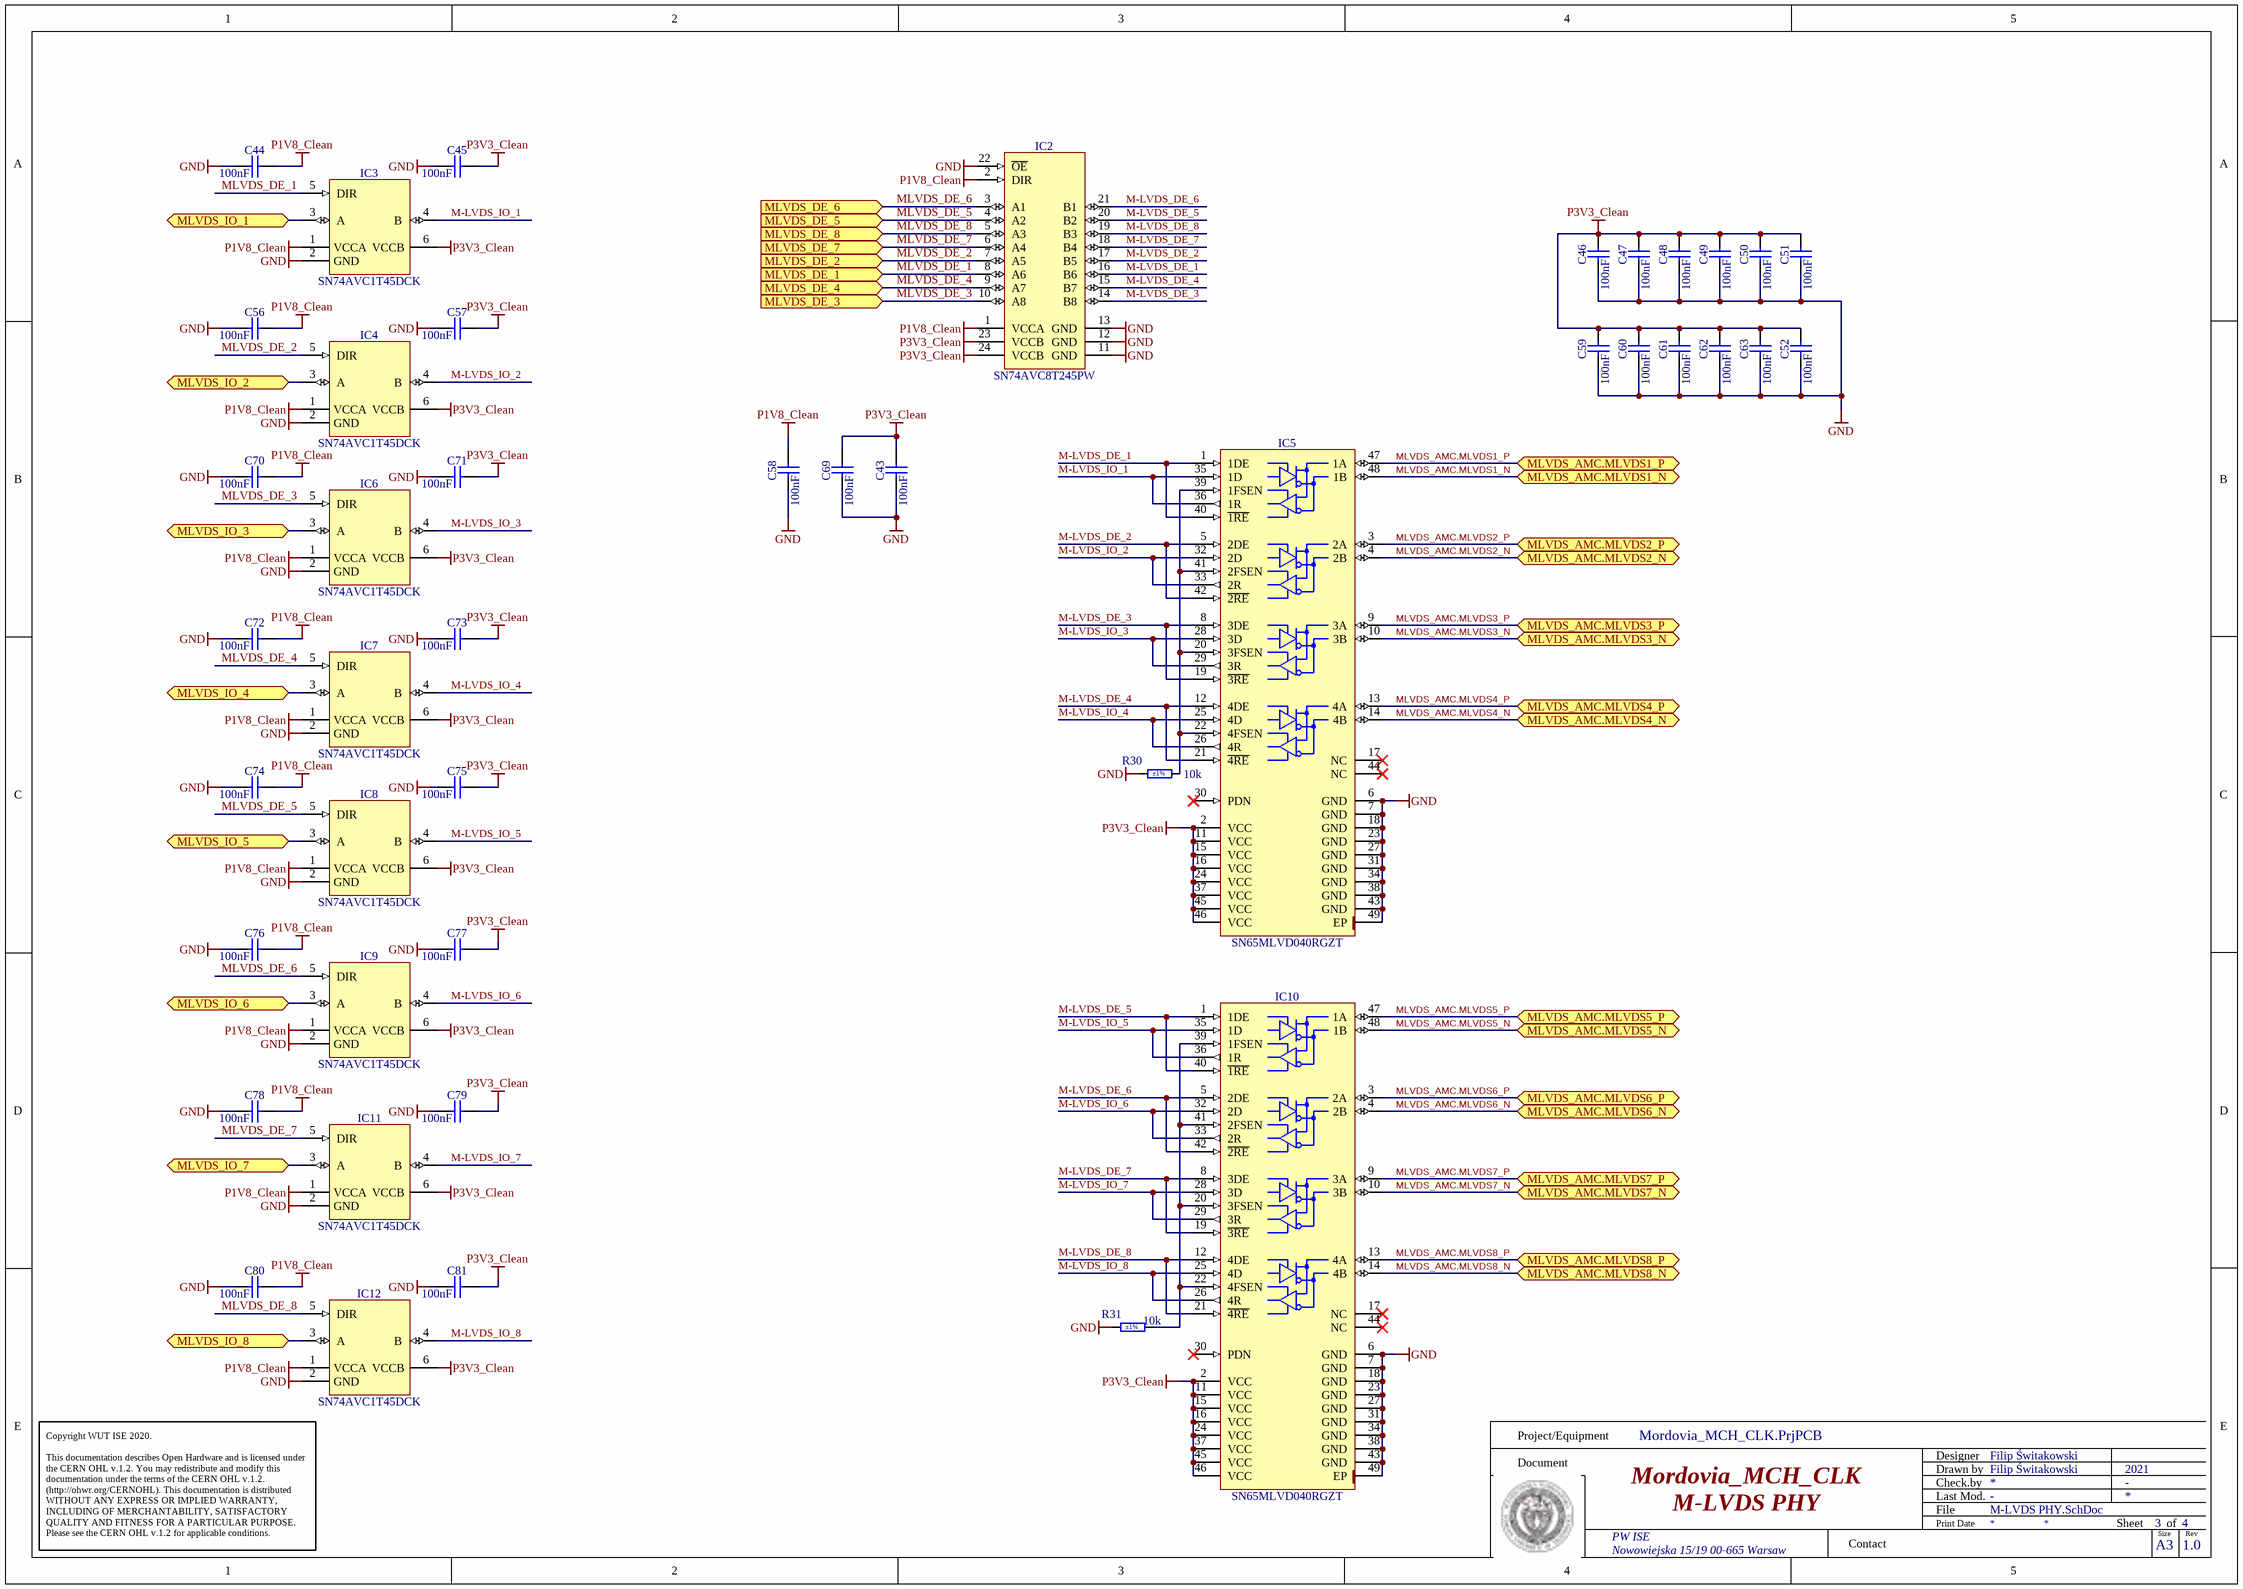
[diagram p3: M-LVDS PHY.SchDoc]

### Parts
C43  100nF  [CAPC1005X55N]
C44  100nF  [CAPC1005X55N]
C45  100nF  [CAPC1005X55N]
C46  100nF  [CAPC1005X55N]
C47  100nF  [CAPC1005X55N]
C48  100nF  [CAPC1005X55N]
C49  100nF  [CAPC1005X55N]
C50  100nF  [CAPC1005X55N]
C51  100nF  [CAPC1005X55N]
C52  100nF  [CAPC1005X55N]
C56  100nF  [CAPC1005X55N]
C57  100nF  [CAPC1005X55N]
C58  100nF  [CAPC1005X55N]
C59  100nF  [CAPC1005X55N]
C60  100nF  [CAPC1005X55N]
C61  100nF  [CAPC1005X55N]
C62  100nF  [CAPC1005X55N]
C63  100nF  [CAPC1005X55N]
C69  100nF  [CAPC1005X55N]
C70  100nF  [CAPC1005X55N]
C71  100nF  [CAPC1005X55N]
C72  100nF  [CAPC1005X55N]
C73  100nF  [CAPC1005X55N]
C74  100nF  [CAPC1005X55N]
C75  100nF  [CAPC1005X55N]
C76  100nF  [CAPC1005X55N]
C77  100nF  [CAPC1005X55N]
C78  100nF  [CAPC1005X55N]
C79  100nF  [CAPC1005X55N]
C80  100nF  [CAPC1005X55N]
C81  100nF  [CAPC1005X55N]
IC2  SN74AVC8T245PW  [SOP65P640X120-24N]
IC3  SN74AVC1T45DCK  [SOT65P210X110-6N]
IC4  SN74AVC1T45DCK  [SOT65P210X110-6N]
IC5  SN65MLVD040RGZT  [QFN50P700X700X100-49N-S420]
IC6  SN74AVC1T45DCK  [SOT65P210X110-6N]
IC7  SN74AVC1T45DCK  [SOT65P210X110-6N]
IC8  SN74AVC1T45DCK  [SOT65P210X110-6N]
IC9  SN74AVC1T45DCK  [SOT65P210X110-6N]
IC10  SN65MLVD040RGZT  [QFN50P700X700X100-49N-S420]
IC11  SN74AVC1T45DCK  [SOT65P210X110-6N]
IC12  SN74AVC1T45DCK  [SOT65P210X110-6N]
R30  10k  Tolerance: ±1%  [RESC1005X40N]
R31  10k  Tolerance: ±1%  [RESC1005X40N]

### Ports
MLVDS_AMC.MLVDS1_N (bidir), MLVDS_AMC.MLVDS1_P (bidir), MLVDS_AMC.MLVDS2_N (bidir), MLVDS_AMC.MLVDS2_P (bidir), MLVDS_AMC.MLVDS3_N (bidir), MLVDS_AMC.MLVDS3_P (bidir), MLVDS_AMC.MLVDS4_N (bidir), MLVDS_AMC.MLVDS4_P (bidir), MLVDS_AMC.MLVDS5_N (bidir), MLVDS_AMC.MLVDS5_P (bidir), MLVDS_AMC.MLVDS6_N (bidir), MLVDS_AMC.MLVDS6_P (bidir), MLVDS_AMC.MLVDS7_N (bidir), MLVDS_AMC.MLVDS7_P (bidir), MLVDS_AMC.MLVDS8_N (bidir), MLVDS_AMC.MLVDS8_P (bidir), MLVDS_DE_1 (in), MLVDS_DE_2 (in), MLVDS_DE_3 (in), MLVDS_DE_4 (in), MLVDS_DE_5 (in), MLVDS_DE_6 (in), MLVDS_DE_7 (in), MLVDS_DE_8 (in), MLVDS_IO_1 (bidir), MLVDS_IO_2 (bidir), MLVDS_IO_3 (bidir), MLVDS_IO_4 (bidir), MLVDS_IO_5 (bidir), MLVDS_IO_6 (bidir), MLVDS_IO_7 (bidir), MLVDS_IO_8 (bidir)

### Nets
GND: C43.1 C44.1 C45.1 C46.1 C47.1 C48.1 C49.1 C50.1 C51.1 C52.1 C56.1 C57.1 C58.1 C59.1 C60.1 C61.1 C62.1 C63.1 C69.1 C70.1 C71.1 C72.1 C73.1 C74.1 C75.1 C76.1 C77.1 C78.1 C79.1 C80.1 C81.1 IC2.11(GND) IC2.12(GND) IC2.13(GND) IC2.22(~{OE}) IC3.2(GND) IC4.2(GND) IC5.6(GND) IC5.7(GND) IC5.18(GND) IC5.23(GND) IC5.27(GND) IC5.31(GND) IC5.34(GND) IC5.38(GND) IC5.43(GND) IC5.49(EP) IC6.2(GND) IC7.2(GND) IC8.2(GND) IC9.2(GND) IC10.6(GND) IC10.7(GND) IC10.18(GND) IC10.23(GND) IC10.27(GND) IC10.31(GND) IC10.34(GND) IC10.38(GND) IC10.43(GND) IC10.49(EP) IC11.2(GND) IC12.2(GND) R30.1 R31.1
P1V8_Clean: C44.2 C56.2 C58.2 C70.2 C72.2 C74.2 C76.2 C78.2 C80.2 IC2.1(VCCA) IC2.2(DIR) IC3.1(VCCA) IC4.1(VCCA) IC6.1(VCCA) IC7.1(VCCA) IC8.1(VCCA) IC9.1(VCCA) IC11.1(VCCA) IC12.1(VCCA)
P3V3_Clean: C43.2 C45.2 C46.2 C47.2 C48.2 C49.2 C50.2 C51.2 C52.2 C57.2 C59.2 C60.2 C61.2 C62.2 C63.2 C69.2 C71.2 C73.2 C75.2 C77.2 C79.2 C81.2 IC2.23(VCCB) IC2.24(VCCB) IC3.6(VCCB) IC4.6(VCCB) IC5.2(VCC) IC5.11(VCC) IC5.15(VCC) IC5.16(VCC) IC5.24(VCC) IC5.37(VCC) IC5.45(VCC) IC5.46(VCC) IC6.6(VCCB) IC7.6(VCCB) IC8.6(VCCB) IC9.6(VCCB) IC10.2(VCC) IC10.11(VCC) IC10.15(VCC) IC10.16(VCC) IC10.24(VCC) IC10.37(VCC) IC10.45(VCC) IC10.46(VCC) IC11.6(VCCB) IC12.6(VCCB)
LA21_N: IC12.3(A) ; port MLVDS_IO_8
LA24_N: IC8.3(A) ; port MLVDS_IO_5
LA25_N: IC9.3(A) ; port MLVDS_IO_6
LA26_N: IC11.3(A) ; port MLVDS_IO_7
LA28_N: IC6.3(A) ; port MLVDS_IO_3
LA29_N: IC7.3(A) ; port MLVDS_IO_4
LA30_N: IC3.3(A) ; port MLVDS_IO_1
LA31_N: IC4.3(A) ; port MLVDS_IO_2
M-LVDS_DE_1: IC2.16(B6) IC5.1(1DE) IC5.40(~{1RE})
M-LVDS_DE_2: IC2.17(B5) IC5.5(2DE) IC5.42(~{2RE})
M-LVDS_DE_3: IC2.14(B8) IC5.8(3DE) IC5.19(~{3RE})
M-LVDS_DE_4: IC2.15(B7) IC5.12(4DE) IC5.21(~{4RE})
M-LVDS_DE_5: IC2.20(B2) IC10.1(1DE) IC10.40(~{1RE})
M-LVDS_DE_6: IC2.21(B1) IC10.5(2DE) IC10.42(~{2RE})
M-LVDS_DE_7: IC2.18(B4) IC10.8(3DE) IC10.19(~{3RE})
M-LVDS_DE_8: IC2.19(B3) IC10.12(4DE) IC10.21(~{4RE})
M-LVDS_IO_1: IC3.4(B) IC5.35(1D) IC5.36(1R)
M-LVDS_IO_2: IC4.4(B) IC5.32(2D) IC5.33(2R)
M-LVDS_IO_3: IC5.28(3D) IC5.29(3R) IC6.4(B)
M-LVDS_IO_4: IC5.25(4D) IC5.26(4R) IC7.4(B)
M-LVDS_IO_5: IC8.4(B) IC10.35(1D) IC10.36(1R)
M-LVDS_IO_6: IC9.4(B) IC10.32(2D) IC10.33(2R)
M-LVDS_IO_7: IC10.28(3D) IC10.29(3R) IC11.4(B)
M-LVDS_IO_8: IC10.25(4D) IC10.26(4R) IC12.4(B)
MLVDS_AMC.MLVDS1_N: IC5.48(1B) ; port MLVDS_AMC.MLVDS1_N
MLVDS_AMC.MLVDS1_P: IC5.47(1A) ; port MLVDS_AMC.MLVDS1_P
MLVDS_AMC.MLVDS2_N: IC5.4(2B) ; port MLVDS_AMC.MLVDS2_N
MLVDS_AMC.MLVDS2_P: IC5.3(2A) ; port MLVDS_AMC.MLVDS2_P
MLVDS_AMC.MLVDS3_N: IC5.10(3B) ; port MLVDS_AMC.MLVDS3_N
MLVDS_AMC.MLVDS3_P: IC5.9(3A) ; port MLVDS_AMC.MLVDS3_P
MLVDS_AMC.MLVDS4_N: IC5.14(4B) ; port MLVDS_AMC.MLVDS4_N
MLVDS_AMC.MLVDS4_P: IC5.13(4A) ; port MLVDS_AMC.MLVDS4_P
MLVDS_AMC.MLVDS5_N: IC10.48(1B) ; port MLVDS_AMC.MLVDS5_N
MLVDS_AMC.MLVDS5_P: IC10.47(1A) ; port MLVDS_AMC.MLVDS5_P
MLVDS_AMC.MLVDS6_N: IC10.4(2B) ; port MLVDS_AMC.MLVDS6_N
MLVDS_AMC.MLVDS6_P: IC10.3(2A) ; port MLVDS_AMC.MLVDS6_P
MLVDS_AMC.MLVDS7_N: IC10.10(3B) ; port MLVDS_AMC.MLVDS7_N
MLVDS_AMC.MLVDS7_P: IC10.9(3A) ; port MLVDS_AMC.MLVDS7_P
MLVDS_AMC.MLVDS8_N: IC10.14(4B) ; port MLVDS_AMC.MLVDS8_N
MLVDS_AMC.MLVDS8_P: IC10.13(4A) ; port MLVDS_AMC.MLVDS8_P
MLVDS_DE_1: IC2.8(A6) IC3.5(DIR) ; port MLVDS_DE_1  [project net LA30_P]
MLVDS_DE_2: IC2.7(A5) IC4.5(DIR) ; port MLVDS_DE_2  [project net LA31_P]
MLVDS_DE_3: IC2.10(A8) IC6.5(DIR) ; port MLVDS_DE_3  [project net LA28_P]
MLVDS_DE_4: IC2.9(A7) IC7.5(DIR) ; port MLVDS_DE_4  [project net LA29_P]
MLVDS_DE_5: IC2.4(A2) IC8.5(DIR) ; port MLVDS_DE_5  [project net LA24_P]
MLVDS_DE_6: IC2.3(A1) IC9.5(DIR) ; port MLVDS_DE_6  [project net LA25_P]
MLVDS_DE_7: IC2.6(A4) IC11.5(DIR) ; port MLVDS_DE_7  [project net LA26_P]
MLVDS_DE_8: IC2.5(A3) IC12.5(DIR) ; port MLVDS_DE_8  [project net LA21_P]
NetIC5_20: IC5.20(3FSEN) IC5.22(4FSEN) IC5.39(1FSEN) IC5.41(2FSEN) R30.2
NetIC10_20: IC10.20(3FSEN) IC10.22(4FSEN) IC10.39(1FSEN) IC10.41(2FSEN) R31.2

Not connected (* = marked no-connect by the designer): IC5 17(NC)* 30(PDN)* 44(NC)*; IC10 17(NC)* 30(PDN)* 44(NC)*

### Notes on the sheet
- Project/Equipment
- Document
- Designer
- Drawn by
- Check.by
- Copyright WUT ISE 2020.
  This documentation describes Open Hardware and is licensed under the CERN OHL v.1.2. You may redistribute and modify this documentation under the terms of the CERN OHL v.1.2. (http://ohwr.org/CERNOHL). This documentation is distributed WITHOUT ANY EXPRESS OR IMPLIED WARRANTY, INCLUDING OF MERCHANTABILITY, SATISFACTORY QUALITY AND FITNESS FOR A PARTICULAR PURPOSE. Please see the CERN OHL v.1.2 for applicable conditions.
- PW ISE
- Contact
- File
- Last Mod.
- Print Date
- Sheet
- Size
- A3
- of
- Rev
- Nowowiejska 15/19 00-665 Warsaw

### Library data of the parts
C43-C52 C56-C63 C69-C81 = CC0402_100NF_50V_10%_X7R: as C13 on sheet CLK_buffer; Part Number: CC0402_100NF_50V_10%_X7R; Component Kind: Standard; Component Type: Standard; Pin Count: 2; Value: 100nF; Status: None; Manufacturer Part Number: CC0402_100NF_50V_10%_X7R; Case: 0402; Mounted: Yes; Socket: No; SMD: Yes; Sense: No; Manufacturer1 Example: MURATA; Manufacturer1 ComponentHeight: 0.55mm; HelpURL: \\cern.ch\dfs\Applications\Altium\Datasheets\CC0402_MURATA_GRM155R71H104KE14D.pdf; Author: CERN DEM MR; CreateDate: 30.06.2017; LatestRevisionDate: 30.06.2017
IC2 = SN74AVC8T245PW: 8-Bit Dual-Supply Bus Transceiver With Configurable Voltage Translation and 3-State Outputs; Manufacturer: TEXAS INSTRUMENTS; PressFit: No; Bonding: No; Part Number: SN74AVC8T245PW; Component Kind: Standard; Component Type: Standard; Device: SN74AVC8T245PW; PackageDescription: SOP, 0.65mm Pitch; 24 Pin, 4.40mm W X 7.80mm L X 1.20mm H Body, IPC Medium Density; Part Description: 8-Bit Dual-Supply Bus Transceiver With Configurable Voltage Translation and 3-State Outputs; Manufacturer Part Number: SN74AVC8T245PW; Pin Count: 24; Case: TSSOP24; Mounted: Yes; Socket: No; SMD: Yes; Sense: No; ComponentHeight: 1.2mm; Author: CERN DEM JLC; HelpURL: \\cern.ch\dfs\Applications\Altium\Datasheets\SN74AVC8T245PW.pdf; CreateDate: 07.03.2012; LatestRevisionDate: 07.03.2012
IC3 IC4 IC6-IC9 IC11 IC12 = SN74AVC1T45DCKR: Single-Bit Dual-Supply Bus Transceiver; Part Description: Single-Bit Dual-Supply Bus Transceiver with Configurable Voltage Translation and 3-State Outputs; Manufacturer: TEXAS INSTRUMENTS; PressFit: No; Bonding: No; Part Number: SN74AVC1T45DCKR; Component Kind: Standard; Component Type: Standard; Device: SN74AVC1T45DCK; PackageDescription: SOT363, SC70-6, 0.65mm Pitch; 6 pin, 1.25mm W X 2.00mm L X 1.10mm H body, IPC Medium Density; Manufacturer Part Number: SN74AVC1T45DCK; Pin Count: 6; Case: SOT363; Mounted: Yes; Socket: No; SMD: Yes; Sense: No; ComponentHeight: 1.1mm; Author: CERN DEM JLC; HelpURL: \\cern.ch\dfs\Applications\Altium\Datasheets\SN74AVC1T45DCKR.pdf; CreateDate: 07.07.2014; LatestRevisionDate: 07.07.2014
IC5 IC10 = SN65MLVD040RGZT: 4-Channel Half-Duplex M-LVDS Line Transceiver; Manufacturer: TEXAS INSTRUMENTS; PressFit: No; Bonding: No; Part Number: SN65MLVD040RGZT; Component Kind: Standard; Component Type: Standard; Device: SN65MLVD040RGZT; PackageDescription: QFN, 0.50mm Pitch, Square; 48 Pin, 7.00mm L X 7.00mm W X 1.00mm H body (w/Thermal Tab 4.20 X 4.20mm), IPC Medium Density; Part Description: 4-Channel Half-Duplex M-LVDS Line Transceiver; Manufacturer Part Number: SN65MLVD040RGZT; Pin Count: 49; Case: QFN48; Mounted: Yes; Socket: No; SMD: Yes; Sense: No; ComponentHeight: 1mm; Author: CERN DEM JLC; HelpURL: \\cern.ch\dfs\Applications\Altium\Datasheets\SN65MLVD040RGZT.pdf; CreateDate: 17.03.2011; LatestRevisionDate: 17.03.2011
R30 R31 = R0402_10K_1%_0.0625W_100PPM: Resistor - 1%; Part Description: General Purpose Thick Film Chip Resistor; Manufacturer: GENERIC; Manufacturer1 Part Number: 232270671003L; TC: ±100ppm/°C; PressFit: No; Part Number: R0402_10K_1%_0.0625W_100PPM; Component Kind: Standard; Component Type: Standard; Pin Count: 2; Value: 10k; Status: Not Recommended; Power: 0.0625W; Manufacturer Part Number: R0402_10K_1%_0.0625W_100PPM; Case: 0402; Mounted: Yes; Sense: No; Socket: No; SMD: Yes; Manufacturer1 Example: YAGEO PHYCOMP; Manufacturer1 ComponentHeight: 0.4mm; HelpURL: \\cern.ch\dfs\Applications\Altium\Datasheets\R0402_Phycomp_RC0402.pdf; Author: CERN DEM JLC; CreateDate: 03.12.2007; LatestRevisionDate: 17.10.2012